# EAGLE design EiBotBoard-v24 (EAGLE 6.5.0)
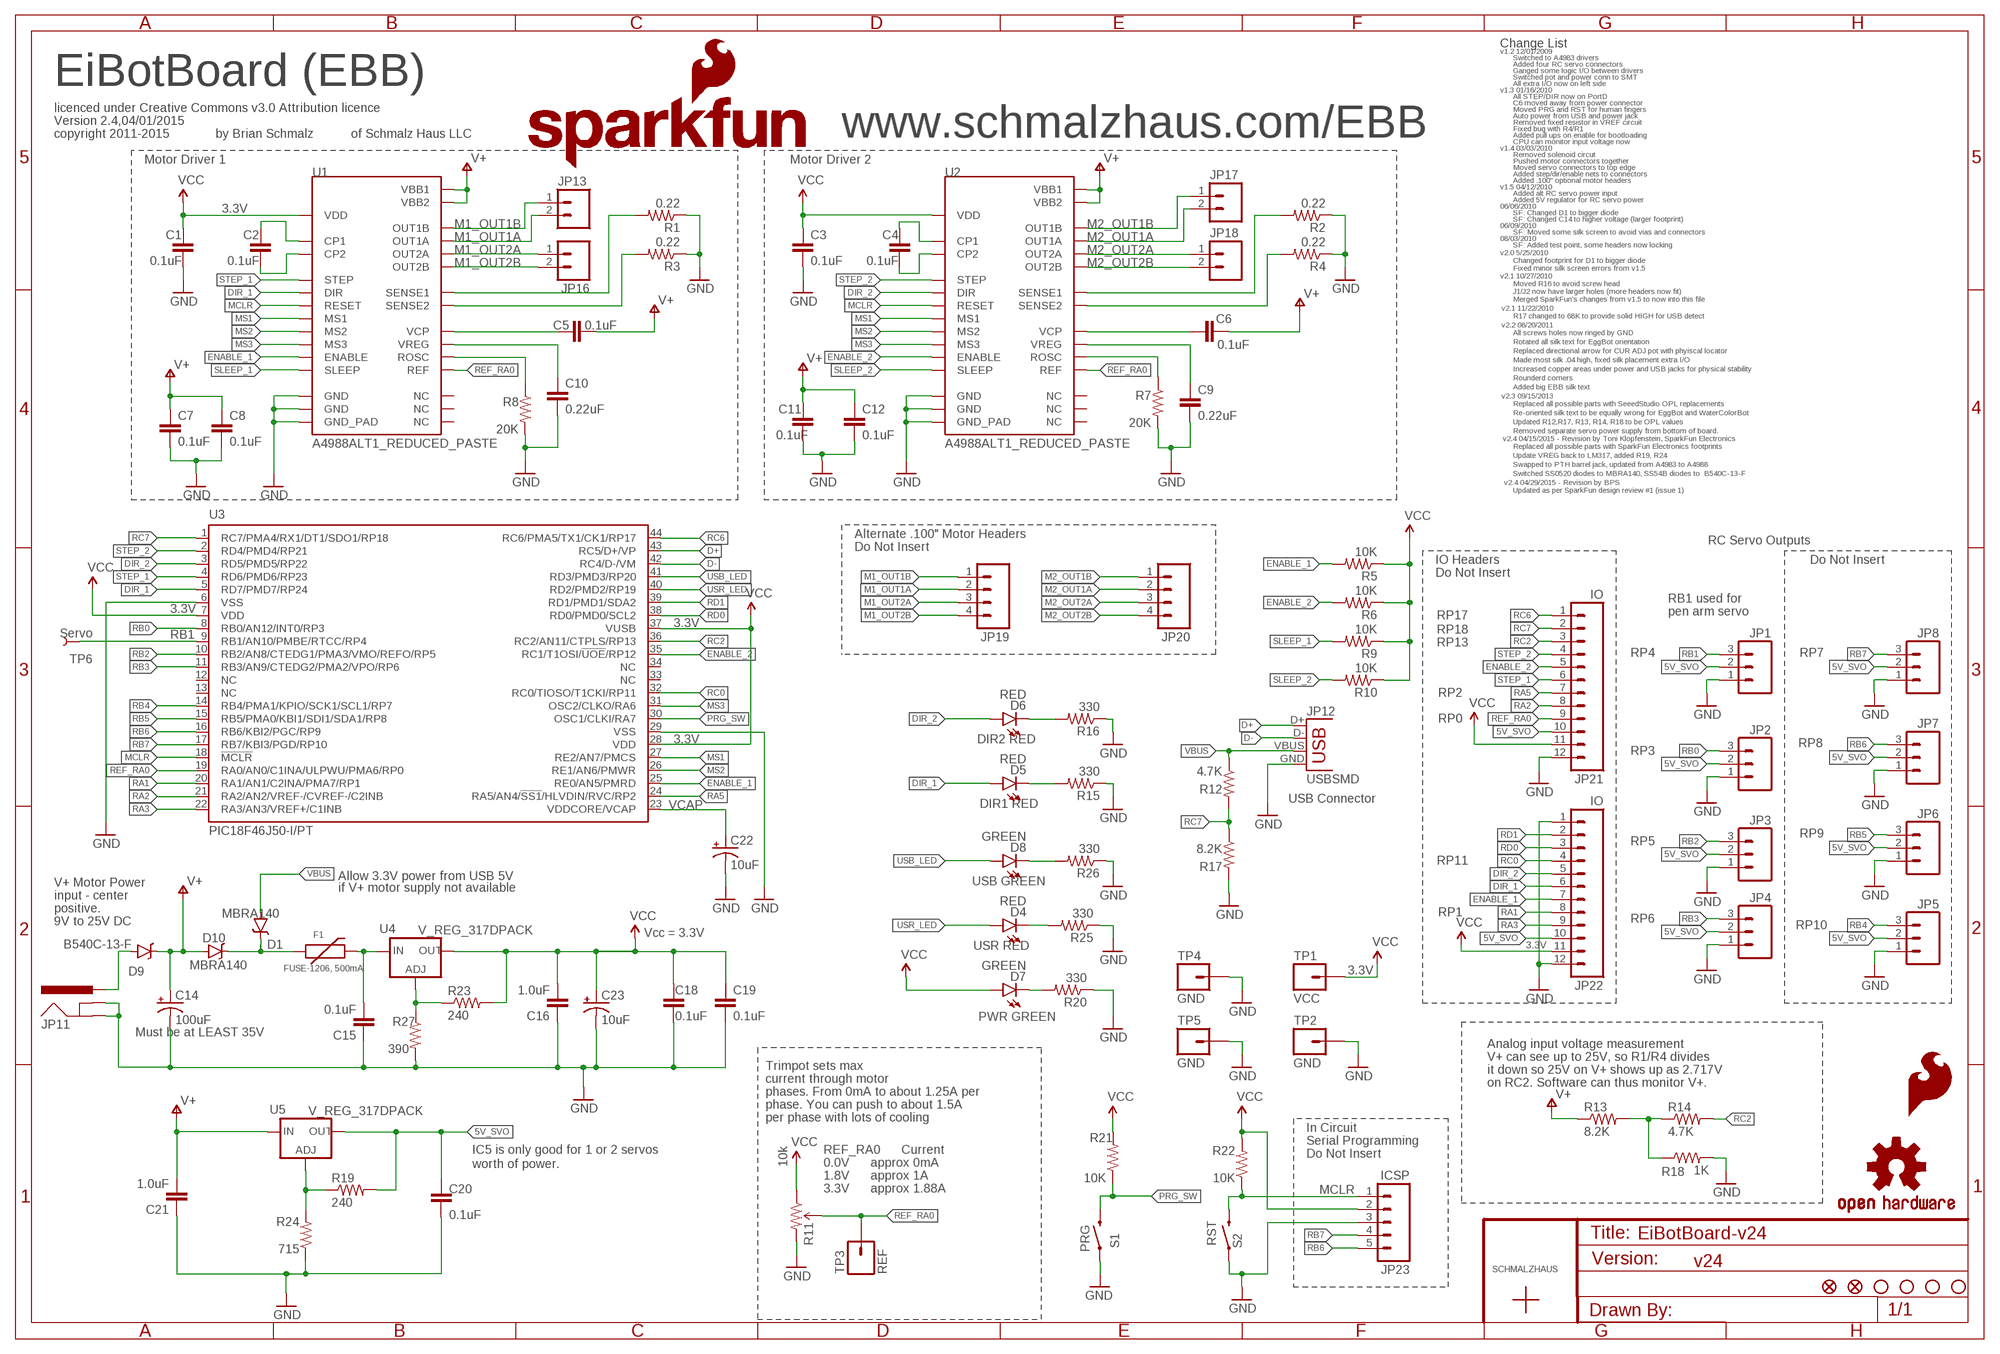
[diagram p0: schematic, sheet 1]

## Parts
C1  0.1uF  0.1UF-100V-10%(0603)  [0603-CAP]
C2  0.1uF  0.1UF-100V-10%(0603)  [0603-CAP]
C3  0.1uF  0.1UF-100V-10%(0603)  [0603-CAP]
C4  0.1uF  0.1UF-100V-10%(0603)  [0603-CAP]
C5  0.1uF  0.1UF-100V-10%(0603)  [0603-CAP]
C6  0.1uF  0.1UF-100V-10%(0603)  [0603-CAP]
C7  0.1uF  0.1UF-100V-10%(0603)  [0603-CAP]
C8  0.1uF  0.1UF-100V-10%(0603)  [0603-CAP]
C9  0.22uF  0.22UF50V-20%,+80%(0603)  [0603-CAP]
C10  0.22uF  0.22UF50V-20%,+80%(0603)  [0603-CAP]
C11  0.1uF  0.1UF-100V-10%(0603)  [0603-CAP]
C12  0.1uF  0.1UF-100V-10%(0603)  [0603-CAP]
C14  100uF  100UF-63V-20%(ELECT)  [NIC_10X10.5_CAP]
C15  0.1uF  0.1UF-100V-10%(0603)  [0603-CAP]
C16  1.0uF  1.0UF-16V-10%(0603)  [0603-CAP]
C18  0.1uF  0.1UF-100V-10%(0603)  [0603-CAP]
C19  0.1uF  0.1UF-100V-10%(0603)  [0603-CAP]
C20  0.1uF  0.1UF-100V-10%(0603)  [0603-CAP]
C21  1.0uF  1.0UF-16V-10%(0603)  [0603-CAP]
C22  10uF  10UF-20V-10%(TANT)  [EIA3528]
C23  10uF  10UF-20V-10%(TANT)  [EIA3528]
D1  MBRA140  DIODE-SCHOTTKY-MBRA140  [SMA-DIODE]
D4  RED  LED-RED0603  [LED-0603]
D5  RED  LED-RED0603  [LED-0603]
D6  RED  LED-RED0603  [LED-0603]
D7  GREEN  LED-GREEN0603  [LED-0603]
D8  GREEN  LED-GREEN0603  [LED-0603]
D9  B540C-13-F  DIODE-SCHOTTKY-B540C-13-F  [SMC]
D10  MBRA140  DIODE-SCHOTTKY-MBRA140  [SMA-DIODE]
F1  FUSE-1206, 500mA  PTCTHERMISTOR1206  [PTC-1206]
JP1  M03LOCK_NO_SILK  [1X03_LOCK_NO_SILK]
JP2  M03LOCK_NO_SILK  [1X03_LOCK_NO_SILK]
JP3  M03LOCK_NO_SILK  [1X03_LOCK_NO_SILK]
JP4  M03LOCK_NO_SILK  [1X03_LOCK_NO_SILK]
JP5  M03LOCK_NO_SILK  [1X03_LOCK_NO_SILK]
JP6  M03LOCK_NO_SILK  [1X03_LOCK_NO_SILK]
JP7  M03LOCK_NO_SILK  [1X03_LOCK_NO_SILK]
JP8  M03LOCK_NO_SILK  [1X03_LOCK_NO_SILK]
JP11  POWER_JACKPTH_LOCK  [POWER_JACK_PTH_LOCK]
JP12  USBSMD  [USB-MINIB]
JP13  M023.5MM_LOCK  [SCREWTERMINAL-3.5MM-2_LOCK]
JP14  FIDUCIAL1X2  [FIDUCIAL-1X2]
JP15  FIDUCIAL1X2  [FIDUCIAL-1X2]
JP16  M023.5MM_LOCK  [SCREWTERMINAL-3.5MM-2_LOCK]
JP17  M023.5MM_LOCK  [SCREWTERMINAL-3.5MM-2_LOCK]
JP18  M023.5MM_LOCK  [SCREWTERMINAL-3.5MM-2_LOCK]
JP19  M04POLAR  [MOLEX-1X4]
JP20  M04POLAR  [MOLEX-1X4]
JP21  IO  M12PTH  [1X12]
JP22  IO  M12PTH  [1X12]
JP23  ICSP  M05NO_SILK  [1X05_NO_SILK]
LOGO1  OSHW-LOGOS  [OSHW-LOGO-S]
LOGO2  SFE_LOGO_FLAME.2_INCH  [SFE_LOGO_FLAME_.2]
LOGO3  SFE_LOGO_NAME_FLAME.2_INCH  [SFE_LOGO_NAME_FLAME_.2]
R1  0.22  0.22OHM-1/4W-1%(0805)  [0805]
R2  0.22  0.22OHM-1/4W-1%(0805)  [0805]
R3  0.22  0.22OHM-1/4W-1%(0805)  [0805]
R4  0.22  0.22OHM-1/4W-1%(0805)  [0805]
R5  10K  10KOHM-1/10W-1%(0603)0603  [0603-RES]
R6  10K  10KOHM-1/10W-1%(0603)0603  [0603-RES]
R7  20K  20KOHM1/10W5%(0603)  [0603-RES]
R8  20K  20KOHM1/10W5%(0603)  [0603-RES]
R9  10K  10KOHM-1/10W-1%(0603)0603  [0603-RES]
R10  10K  10KOHM-1/10W-1%(0603)0603  [0603-RES]
R11  10k  TRIMPOTRES-09285  [TRIMPOT-3MM]
R12  4.7K  4.7KOHM-1/10W-1%(0603)  [0603-RES]
R13  8.2K  8.2KOHM-1/10W-5%(0603)  [0603-RES]
R14  4.7K  4.7KOHM-1/10W-1%(0603)  [0603-RES]
R15  330  330OHM1/10W1%(0603)  [0603-RES]
R16  330  330OHM1/10W1%(0603)  [0603-RES]
R17  8.2K  8.2KOHM-1/10W-5%(0603)  [0603-RES]
R18  1K  1KOHM-1/10W-1%(0603)  [0603-RES]
R19  240  240OHM1/10W1%(0603)  [0603-RES]
R20  330  330OHM1/10W1%(0603)  [0603-RES]
R21  10K  10KOHM-1/10W-1%(0603)0603  [0603-RES]
R22  10K  10KOHM-1/10W-1%(0603)0603  [0603-RES]
R23  240  240OHM1/10W1%(0603)  [0603-RES]
R24  715  715OHM1/10W1%(0603)  [0603-RES]
R25  330  330OHM1/10W1%(0603)  [0603-RES]
R26  330  330OHM1/10W1%(0603)  [0603-RES]
R27  390  390OHM1/10W1%(0603)  [0603-RES]
S1  SWITCH-MOMENTARY-2SMD  [TACTILE-SWITCH-SMD]
S2  SWITCH-MOMENTARY-2SMD  [TACTILE-SWITCH-SMD]
TP1  VCC  M01_WIDENOSLIK  [1X01_NOSILK]
TP2  GND  M01_WIDENOSLIK  [1X01_NOSILK]
TP3  REF  M01PTH  [1X01]
TP4  GND  M01_WIDENOSLIK  [1X01_NOSILK]
TP5  GND  M01_WIDENOSLIK  [1X01_NOSILK]
TP6  Servo  TEST-POINT3X5  [PAD.03X.05]
U1  A4988ALT1_REDUCED_PASTE  [QFN-28-5MM_ALT1_REDUCED_PASTE]
U2  A4988ALT1_REDUCED_PASTE  [QFN-28-5MM_ALT1_REDUCED_PASTE]
U3  PIC18F46J50-I/PT  PIC18F4J50  [TQFP44]
U4  V_REG_317DPACK  [V-REG_DPACK]
U5  V_REG_317DPACK  [V-REG_DPACK]
U$1  SCHMALZHAUSSCHMALZHAUS_SMALL  [SCHMALZHAUS_SMALL]
U$2  STAND-OFF  [STAND-OFF]
U$3  STAND-OFF  [STAND-OFF]
U$4  STAND-OFF  [STAND-OFF]
U$5  STAND-OFF  [STAND-OFF]

## Nets
3.3V: C1.1 C3.1 C16.2 C18.2 C19.2 C23.A(+) D7.A JP21.11 JP22.11 JP23.2 R5.1 R6.1 R9.1 R10.1 R11.1(CCW) R21.2 R22.2 R23.2 TP1.1 U1.P$15(VDD) U2.P$15(VDD) U3.7(VDD) U3.28(VDD) U3.37(VUSB) U4.4(OUT) ; supply symbol labelled VCC
5V_SVO: C20.2 JP1.2 JP2.2 JP3.2 JP4.2 JP5.2 JP6.2 JP7.2 JP8.2 JP21.10 JP22.10 R19.2 U5.4(OUT)
D+: JP12.D+ U3.43(RC5/D+/VP)
D-: JP12.D- U3.42(RC4/D-/VM)
DIR_1: D5.A JP22.6 U1.P$19(DIR) U3.5(RD7/PMD7/RP24)
DIR_2: D6.A JP22.5 U2.P$19(DIR) U3.3(RD5/PMD5/RP22)
ENABLE_1: JP22.7 R5.2 U1.P$2(ENABLE) U3.25(RE0/AN5/PMRD)
ENABLE_2: JP21.5 R6.2 U2.P$2(ENABLE) U3.35(RC1/T1OSI/!UOE!/RP12)
GND: C1.2 C3.2 C7.2 C8.2 C9.2 C10.2 C11.2 C12.2 C14.- C15.1 C16.1 C18.1 C19.1 C20.1 C21.1 C22.C(-) C23.C(-) JP1.1 JP2.1 JP3.1 JP4.1 JP5.1 JP6.1 JP7.1 JP8.1 JP11.GND JP11.GNDBREAK JP12.GND JP21.12 JP22.1 JP22.12 JP23.3 R1.1 R2.1 R3.1 R4.1 R7.2 R8.2 R11.3(CW) R15.1 R16.1 R17.2 R18.2 R20.1 R24.1 R25.1 R26.1 R27.2 S1.1 S2.1 TP2.1 TP4.1 TP5.1 U1.P$3(GND) U1.P$18(GND) U1.P$29(GND_PAD) U2.P$3(GND) U2.P$18(GND) U2.P$29(GND_PAD) U3.6(VSS) U3.29(VSS)
M1_OUT1A: JP13.2 JP19.2 U1.P$24(OUT1A)
M1_OUT1B: JP13.1 JP19.1 U1.P$21(OUT1B)
M1_OUT2A: JP16.1 JP19.3 U1.P$26(OUT2A)
M1_OUT2B: JP16.2 JP19.4 U1.P$1(OUT2B)
M2_OUT1A: JP17.2 JP20.2 U2.P$24(OUT1A)
M2_OUT1B: JP17.1 JP20.1 U2.P$21(OUT1B)
M2_OUT2A: JP18.1 JP20.3 U2.P$26(OUT2A)
M2_OUT2B: JP18.2 JP20.4 U2.P$1(OUT2B)
MCLR: JP23.1 R22.1 S2.3 U1.P$12(RESET) U2.P$12(RESET) U3.18(!MCLR!)
MS1: U1.P$9(MS1) U2.P$9(MS1) U3.27(RE2/AN7/PMCS)
MS2: U1.P$10(MS2) U2.P$10(MS2) U3.26(RE1/AN6/PMWR)
MS3: U1.P$11(MS3) U2.P$11(MS3) U3.31(OSC2/CLKO/RA6)
N$1: D6.C R16.2
N$2: D1.C D10.C F1.1
N$3: C2.1 U1.P$4(CP1)
N$4: R13.2 R14.1 R18.1
N$5: C2.2 U1.P$5(CP2)
N$6: D9.A JP11.PWR
N$7: D5.C R15.2
N$8: D8.C R26.2
N$9: R23.1 R27.1 U4.1(ADJ)
N$10: D4.C R25.2
N$11: D7.C R20.2
N$12: R19.1 R24.2 U5.1(ADJ)
N$16: C4.1 U2.P$4(CP1)
N$17: C4.2 U2.P$5(CP2)
N$19: R8.1 U1.P$13(ROSC)
N$20: C10.1 U1.P$8(VREG)
N$21: C5.1 U1.P$6(VCP)
N$31: R3.2 U1.P$27(SENSE2)
N$32: R1.2 U1.P$23(SENSE1)
N$36: C15.2 F1.2 U4.3(IN)
N$41: C6.1 U2.P$6(VCP)
N$43: R2.2 U2.P$23(SENSE1)
N$44: R4.2 U2.P$27(SENSE2)
N$45: C9.1 U2.P$8(VREG)
N$48: R7.1 U2.P$13(ROSC)
PRG_SW: R21.1 S1.3 U3.30(OSC1/CLKI/RA7)
RA1: JP22.8 U3.20(RA1/AN1/C2INA/PMA7/RP1)
RA2: JP21.8 U3.21(RA2/AN2/VREF-/CVREF-/C2INB)
RA3: JP22.9 U3.22(RA3/AN3/VREF+/C1INB)
RA5: JP21.7 U3.24(RA5/AN4/!SS1!/HLVDIN/RVC/RP2)
RB0: JP2.3 U3.8(RB0/AN12/INT0/RP3)
RB1: JP1.3 TP6.P$1 U3.9(RB1/AN10/PMBE/RTCC/RP4)
RB2: JP3.3 U3.10(RB2/AN8/CTEDG1/PMA3/VMO/REFO/RP5)
RB3: JP4.3 U3.11(RB3/AN9/CTEDG2/PMA2/VPO/RP6)
RB4: JP5.3 U3.14(RB4/PMA1/KPIO/SCK1/SCL1/RP7)
RB5: JP6.3 U3.15(RB5/PMA0/KBI1/SDI1/SDA1/RP8)
RB6: JP7.3 JP23.5 U3.16(RB6/KBI2/PGC/RP9)
RB7: JP8.3 JP23.4 U3.17(RB7/KBI3/PGD/RP10)
RC0: JP22.4 U3.32(RC0/TIOSO/T1CKI/RP11)
RC2: JP21.3 R14.2 U3.36(RC2/AN11/CTPLS/RP13)
RC6: JP21.1 U3.44(RC6/PMA5/TX1/CK1/RP17)
RC7: JP21.2 R12.2 R17.1 U3.1(RC7/PMA4/RX1/DT1/SDO1/RP18)
RD0: JP22.3 U3.38(RD0/PMD0/SCL2)
RD1: JP22.2 U3.39(RD1/PMD1/SDA2)
REF_RA0: JP21.9 R11.2(WIPER) TP3.1 U1.P$17(REF) U2.P$17(REF) U3.19(RA0/AN0/C1INA/ULPWU/PMA6/RP0)
SLEEP_1: R9.2 U1.P$14(SLEEP)
SLEEP_2: R10.2 U2.P$14(SLEEP)
STEP_1: JP21.6 U1.P$16(STEP) U3.4(RD6/PMD6/RP23)
STEP_2: JP21.4 U2.P$16(STEP) U3.2(RD4/PMD4/RP21)
USB_LED: D8.A U3.41(RD3/PMD3/RP20)
USR_LED: D4.A U3.40(RD2/PMD2/RP19)
V+: C5.2 C6.2 C7.1 C8.1 C11.1 C12.1 C14.+ C21.2 D9.C D10.A R13.1 U1.P$22(VBB1) U1.P$28(VBB2) U2.P$22(VBB1) U2.P$28(VBB2) U5.3(IN)
VBUS: D1.A JP12.VBUS R12.1
VCAP: C22.A(+) U3.23(VDDCORE/VCAP)
Unconnected: U1.P$7(NC) U1.P$20(NC) U1.P$25(NC) U2.P$7(NC) U2.P$20(NC) U2.P$25(NC) U3.12(NC) U3.13(NC) U3.33(NC) U3.34(NC)

## Notes on the sheet
- Change List
- v1.2 12/01/2009
- Switched to A4983 drivers
- Added four RC servo connectors
- Ganged some logic I/O between drivers
- Switched pot and power conn to SMT
- EiBotBoard (EBB) | All extra I/O now on left side
- v1.3 01/16/2010
- All STEP/DIR now on PortD
- C6 moved away from power connector
- licenced under Creative Commons v3.0 Attribution licence | Moved PRG and RST for human fingers
- Auto power from USB and power jack
- Version 2.4,04/01/2015 | Removed fixed resistor in VREF circuit
- Fixed bug with R4/R1
- copyright 2011-2015 | by Brian Schmalz | of Schmalz Haus LLC | www.schmalzhaus.com/EBB | Added pull ups on enable for bootloading
- CPU can monitor input voltage now
- v1.4 03/03/2010
- Removed solenoid circut
- Motor Driver 1 | Motor Driver 2 | Pushed motor connectors together
- Moved servo connectors to top edge
- Added step/dir/enable nets to connectors
- Added .100" optional motor headers
- v1.5 04/12/2010
- Added alt RC servo power input
- Added 5V regulator for RC servo power
- 06/06/2010
- SF: Changed D1 to bigger diode
- SF: Changed C14 to higher voltage (larger footprint)
- 06/09/2010
- SF: Moved some silk screen to avoid vias and connectors
- 08/03/2010
- SF: Added test point, some headers now locking
- v2.0 5/25/2010
- Changed footprint for D1 to bigger diode
- Fixed minor silk screen errors from v1.5
- v2.1 10/27/2010
- Moved R16 to avoid screw head
- J1/J2 now have larger holes (more headers now fit)
- Merged SparkFun's changes from v1.5 to now into this file
- v2.1 11/22/2010
- R17 changed to 68K to provide solid HIGH for USB detect
- v2.2 08/20/2011
- All screws holes now ringed by GND
- Rotated all silk text for EggBot orientation
- Replaced directional arrow for CUR ADJ pot with phyiscal locator
- Made most silk .04 high, fixed silk placement extra I/O
- Increased copper areas under power and USB jacks for physical stability
- Rounderd corners
- Added big EBB silk text
- v2.3 09/15/2013
- Replaced all possible parts with SeeedStudio OPL replacements
- Re-oriented silk text to be equally wrong for EggBot and WaterColorBot
- Updated R12,R17, R13, R14, R18 to be OPL values
- Removed separate servo power supply from bottom of board.
- v2.4 04/15/2015 - Revision by Toni Klopfenstein, SparkFun Electronics
- Replaced all possible parts with SparkFun Electronics footprints
- Update VREG back to LM317, added R19, R24
- Swapped to PTH barrel jack, updated from A4983 to A4988
- Switched SS0520 diodes to MBRA140, SS54B diodes to  B540C-13-F
- v2.4 04/29/2015 - Revision by BPS
- Updated as per SparkFun design review #1 (issue 1)
- Alternate .100" Motor Headers
- RC Servo Outputs
- Do Not Insert
- IO Headers | Do Not Insert
- Do Not Insert
- RB1 used for
- pen arm servo
- RP17
- RP18
- RP13
- RP4 | RP7
- RP2
- RP0
- DIR2 RED
- RP8
- RP3
- USB Connector
- DIR1 RED
- RP9
- RP5
- RP11
- Allow 3.3V power from USB 5V
- V+ Motor Power | USB GREEN
- if V+ motor supply not available
- input - center
- positive.
- RP1
- 9V to 25V DC | RP6
- RP10
- Vcc = 3.3V
- USR RED
- PWR GREEN
- Must be at LEAST 35V
- Analog input voltage measurement
- V+ can see up to 25V, so R1/R4 divides
- Trimpot sets max
- it down so 25V on V+ shows up as 2.717V
- current through motor
- on RC2. Software can thus monitor V+.
- phases. From 0mA to about 1.25A per
- phase. You can push to about 1.5A
- per phase with lots of cooling
- In Circuit
- Serial Programming
- IC5 is only good for 1 or 2 servos | REF_RA0      Current
- Do Not Insert
- worth of power. | 0.0V      approx 0mA
- 1.8V      approx 1A
- 3.3V      approx 1.88A
- PRG
- RST
- v24

## Library data of the parts
C1-C8 C11 C12 C15 C18-C20 = SparkFun-Capacitors:0.1UF-100V-10%(0603): CAP-08390; PROD_ID: CAP-08390
C9 C10 = SparkFun-Capacitors:0.22UF50V-20%,+80%(0603): CAP-09885; PROD_ID: CAP-09885
C14 = SparkFun-Capacitors:100UF-63V-20%(ELECT): CAP-08362 100uF electrolytic SMT 63V 20%; PROD_ID: CAP-08362
C16 C21 = SparkFun-Capacitors:1.0UF-16V-10%(0603): CAP-00868; PROD_ID: CAP-00868
C22 C23 = SparkFun-Capacitors:10UF-20V-10%(TANT): CAP-08063; PROD_ID: CAP-08063
D1 D10 = SparkFun-DiscreteSemi:DIODE-SCHOTTKY: Schottky diodes in SFE's production catalog; PROD_ID: DIO-08053
D4-D6 = SparkFun-LED:LED-RED: Assorted Red LEDs LilyPad 1206- DIO-09912 1206- DIO-00809 0603- DIO-00819 "SMART" means more efficient and expensive; PROD_ID: DIO-00819
D7 D8 = SparkFun-LED:LED-GREEN: Various green LEDs Green LEDs used in SFE Production 0603- DIO-00821 LARGE- DIO-00862 LILYPAD- DIO-09910; PROD_ID: DIO-00821
D9 = Testing:DIODE-SCHOTTKY: Schottky diodes in SFE's production catalog; PROD_ID: PROTOTYPE
F1 = SparkFun-PowerIC:PTC: Resettable Fuse PTC Resettable Fuse. Spark Fun Electronics SKU : COM-08357; PROD_ID: RES-08585
JP1-JP8 = SparkFun-Connectors:M03: Header 3 Standard 3-pin 0.1" header. Use with straight break away headers (SKU : PRT-00116), right angle break away headers (PRT-00553), swiss pins (PRT-00743), machine pins (PRT-00117), and female headers (PRT-00115). Molex polarized connector foot print use with SKU : PRT-08232 with associated crimp pins and housings.
JP11 = SparkFun-Connectors:POWER_JACK: Power Jack This is the standard 5.5mm barrel jack for power. The PTH is the most common, proven, reliable, footprint. The Slot footprint only works if the mill layer is transmitted to the PCB fab house so be warned. Mating wall wart : TOL-00298 (and others); PROD_ID: CONN-08197; SF_ID: PRT-00119
JP12 = SparkFun-Connectors:USB: USB Connectors USB-B-PTH is fully proven SKU : PRT-00139/CONN-08278 USB-miniB is fully proven SKU : PRT-00587 USB-A-PCB is untested. USB-A-H is throughly reviewed, but untested. Spark Fun Electronics SKU : PRT-00437 USB-B-SMT is throughly reviewed, but untested. Needs silkscreen touching up. USB-A-S has not been used/tested USB-MB-H has not been used/tested USB-MICROB has been used. CONN-09505; PROD_ID: CONN-08193
JP13 JP16-JP18 = SparkFun-Connectors:M02: Standard 2-pin 0.1" header. Use with - straight break away headers ( PRT-00116) - right angle break away headers (PRT-00553) - swiss pins (PRT-00743) - machine pins (PRT-00117) - female headers (PRT-00115) Molex polarized connector foot print use with: PRT-08233 with associated crimp pins and housings. 2.54_SCREWTERM for use with PRT-10571. 3.5mm Screw Terminal footprints for PRT-08084 5mm Screw Terminal footprints for use with PRT-08432; PROD_ID: CONN-08399
JP14 JP15 = SparkFun-Aesthetics:FIDUCIAL: Fiducial Alignment Points Various fiducial points for machine vision alignment.
JP19 JP20 = SparkFun-Connectors:M04: Header 4 Standard 4-pin 0.1" header. Use with straight break away headers (SKU : PRT-00116), right angle break away headers (PRT-00553), swiss pins (PRT-00743), machine pins (PRT-00117), and female headers (PRT-00115). Molex polarized connector foot print use with SKU : PRT-08231 with associated crimp pins and housings. 1MM SMD Version SKU: PRT-10208
JP21 JP22 = SparkFun-Connectors:M12: Header 12 Standard 12-pin 0.1" header. Use with straight break away headers (SKU : PRT-00116), right angle break away headers (PRT-00553), swiss pins (PRT-00743), machine pins (PRT-00117), and female headers (PRT-00115).
JP23 = SparkFun-Connectors:M05: Header 5 Standard 5-pin 0.1" header. Use with straight break away headers (SKU : PRT-00116), right angle break away headers (PRT-00553), swiss pins (PRT-00743), machine pins (PRT-00117), and female headers (PRT-00115). Molex polarized connector foot print use with SKU : PRT-08230 with associated crimp pins and housings.
LOGO1 = SparkFun-Aesthetics:OSHW-LOGO: Open Source Hardware Logo This logo indicates the piece of hardware it is found on incorporates a OSHW license and/or adheres to the definition of open source hardware found here: http://freedomdefined.org/OSHW
LOGO2 = SparkFun-Aesthetics:SFE_LOGO_FLAME: SFE Logo, flame only This is the SparkFun flame logo. The logo on the schematic will always be the same size; the package variant is the height of the flame. Default layer for the logo on the board is tSilk.
LOGO3 = SparkFun-Aesthetics:SFE_LOGO_NAME_FLAME: SFE Logo, name and flame This is the SparkFun full logo. The logo on the schematic will always be the same size; the package variant is the height of the flame part of the logo. Default layer for the logo on the board is tSilk.
R1-R4 = SparkFun-Resistors:0.22OHM-1/4W-1%(0805): RES-09883; PROD_ID: RES-09883
R5 R6 R9 R10 R21 R22 = SparkFun-Resistors:10KOHM-1/10W-1%(0603): RES-00824; PROD_ID: RES-00824
R7 R8 = SparkFun-Resistors:20KOHM1/10W5%(0603): RES-09231; PROD_ID: RES-09231
R11 = SparkFun-Electromechanical:TRIMPOT: Various small potentiometers for "set-and-forget" applications; PROD_ID: RES-09285
R12 R14 = SparkFun-Resistors:4.7KOHM-1/10W-1%(0603): RES-07857; PROD_ID: RES-07857
R13 R17 = SparkFun-Resistors:8.2KOHM-1/10W-5%(0603): RES-10646; PROD_ID: RES-10646
R15 R16 R20 R25 R26 = SparkFun-Resistors:330OHM1/10W1%(0603): RES-00818; PROD_ID: RES-00818
R18 = SparkFun-Resistors:1KOHM-1/10W-1%(0603): RES-07856; PROD_ID: RES-07856
R19 R23 = SparkFun-Resistors:240OHM1/10W1%(0603): RES-07849; PROD_ID: RES-07849
R24 = SparkFun-Resistors:715OHM1/10W1%(0603): RES-07850; PROD_ID: RES-07850
R27 = SparkFun-Resistors:390OHM1/10W1%(0603): RES-07864; PROD_ID: RES-07864
S1 S2 = SparkFun-Electromechanical:SWITCH-MOMENTARY-2: Various NO switches- pushbuttons, reed, etc; PROD_ID: SWCH-08247
TP1 TP2 TP4 TP5 = SchmalzHaus:M01_WIDE: Header 1 Standard 1-pin 0.1" header. Use with straight break away headers (SKU : PRT-00116), right angle break away headers (PRT-00553), swiss pins (PRT-00743), machine pins (PRT-00117), and female headers (PRT-00115).
TP3 = SparkFun-Connectors:M01: Header 1 Standard 1-pin 0.1" header. Use with straight break away headers (SKU : PRT-00116), right angle break away headers (PRT-00553), swiss pins (PRT-00743), machine pins (PRT-00117), and female headers (PRT-00115).
TP6 = SparkFun-Passives:TEST-POINT: Bare copper test points for troubleshooting or ICT
U1 U2 = SparkFun-PowerIC:A4988: DMOS Microstepping Driver with Translator; PROD_ID: IC-11483
U3 = Testing:PIC18F4*J50; PROD_ID: IC-09891
U4 U5 = SparkFun-PowerIC:V_REG_317: Voltage Regulator Standard LM317 adjustable voltage regulator. AOI (Adjust Output Input). Google 'LM317 Calculator' for easy to use app to get the two resistor values needed. 240/720 for 5V output. 240/390 for 3.3V output. Spark Fun Electronics SKU : COM-00527; PROD_ID: IC-09888
U$1 = SchmalzHaus:SCHMALZHAUS
U$2-U$5 = SparkFun-Electromechanical:STAND-OFF: #4 Stand Off This is the mechanical footprint for a #4 phillips button head screw. Use the keepout ring to avoid running the screw head into surrounding components. SKU : PRT-00447

## Board
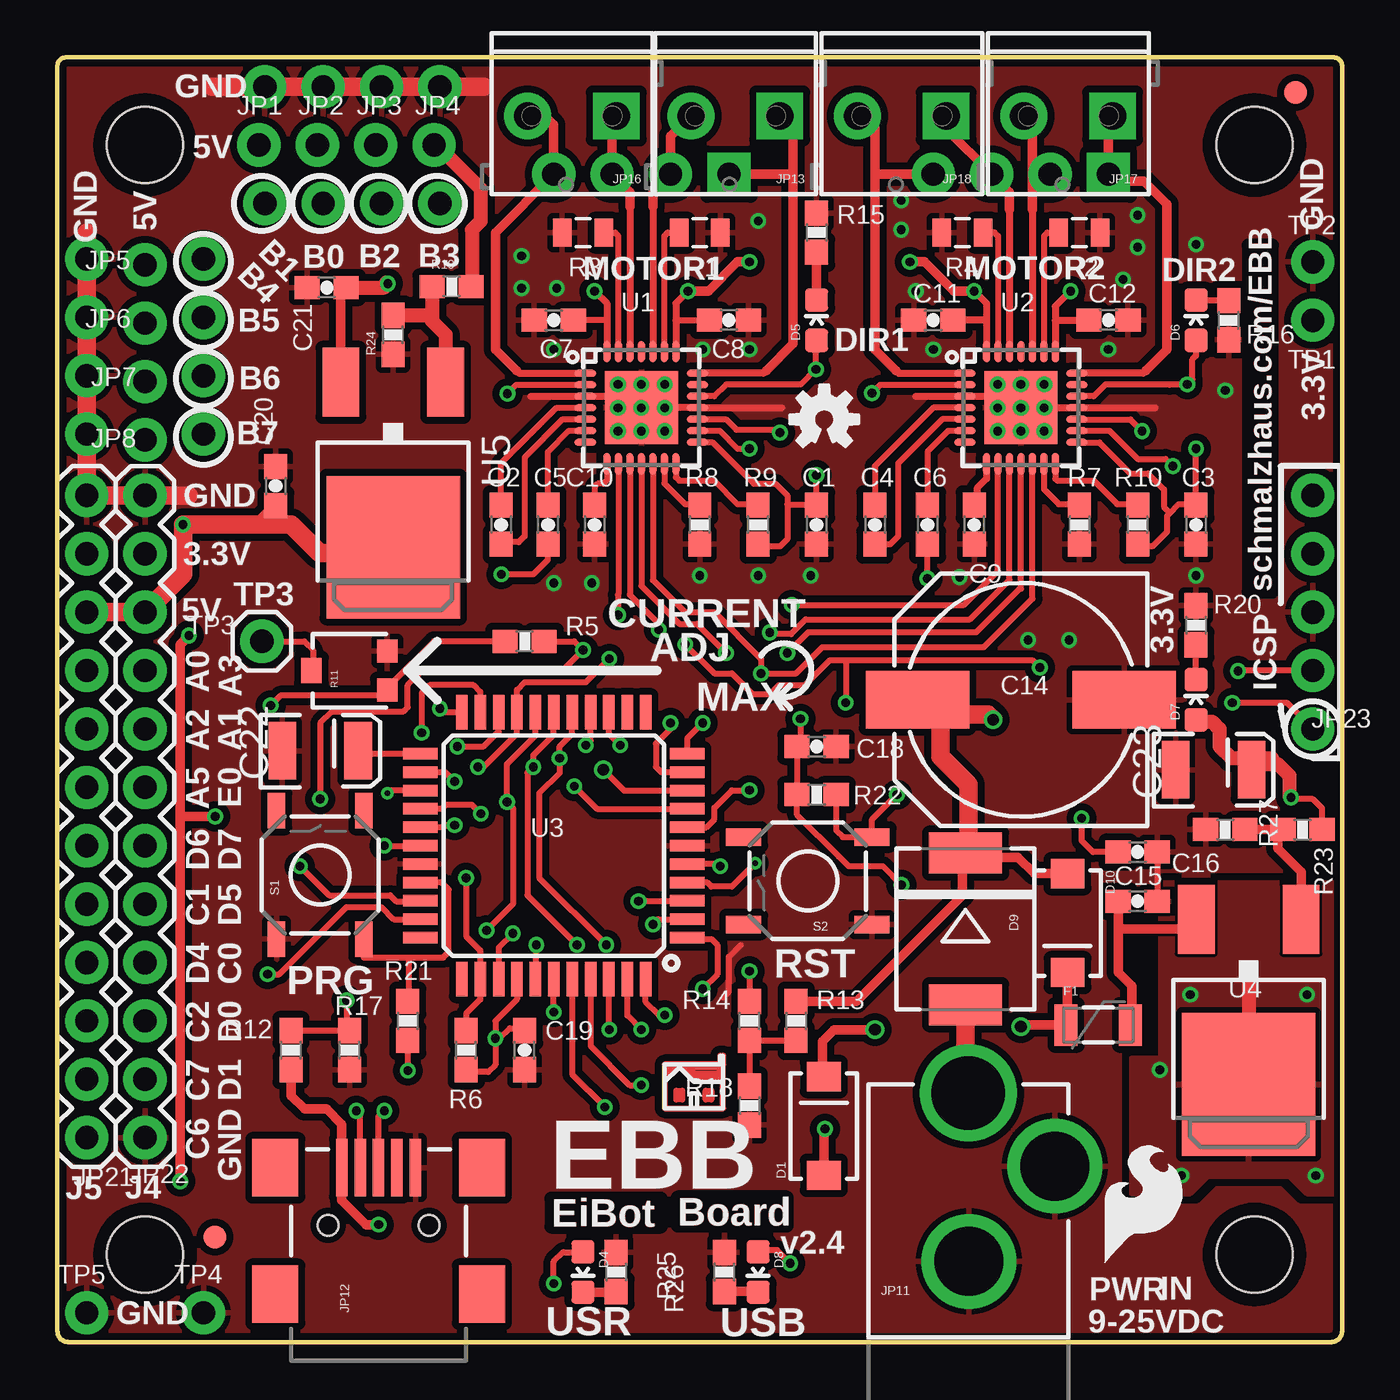
[diagram p1: board, top side]
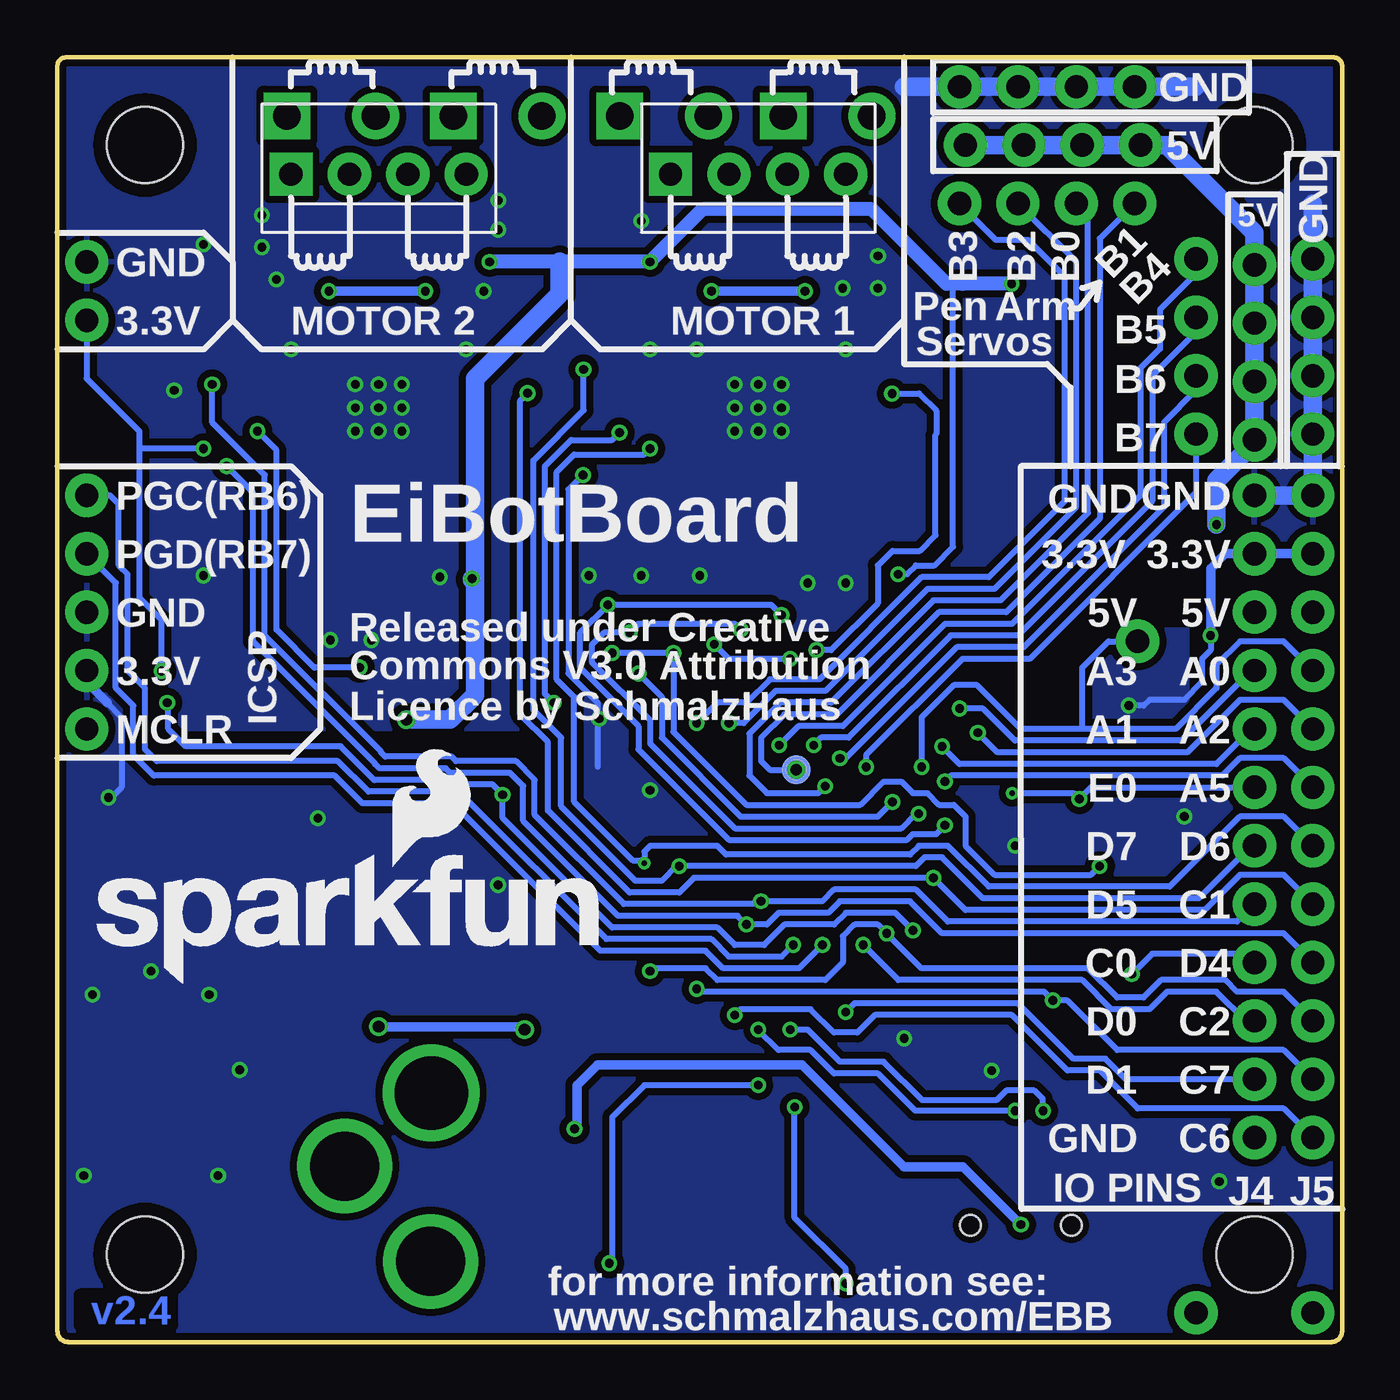
[diagram p2: board, bottom side, seen from below]

Size 55.88 x 55.88 mm. Coordinates in mm from the lower left corner, seen from the top.
Outline: 55.42,0 arc90 55.88,0.46 55.88,55.54 arc90 55.54,55.88 0.34,55.88 arc90 0,55.54 0,0.46 arc90 0.46,0 55.42,0
Copper layers (1*16): Top 0.035mm / dielectric 1.5mm / Bottom 0.035mm
Design rules "dirt_cheap_dirty_boards.v1": minimum track width 5mil, minimum drill 12mil, track to track 5mil, track to pad 5mil, pad to pad 5mil, via to via 5mil, smd to smd 0mil, copper to edge 10mil, drill to drill 10mil, minimum pad ring 10mil, minimum via ring 6mil, stop-mask expansion 2mil, vias tented up to drill 25mil, thermal gap 10mil

### Footprints (pad centres in the part's own frame; a part is rotated, then mirrored left to right if it is on the bottom)
0603-CAP = smd 1.1 x 1: 1 -0.85,0; 2 0.85,0
NIC_10X10.5_CAP = smd 4.5 x 2.5: + 4.5,0; - -4.5,0
EIA3528 = smd 1.2 x 2.5: A 1.65,0; C -1.65,0
SMA-DIODE = smd 1.27 x 1.47: A -2.15,0; C 2.15,0
LED-0603 = smd 1 x 1: A 0,-0.877; C 0,0.877
SMC = smd 1.778 x 3.175: A 3.302,0; C -3.302,0
PTC-1206 = smd 1 x 1.8: 1 -1.4,0; 2 1.4,0
1X03_LOCK_NO_SILK = drill 1.016 pad 1.88: 1 0,0.127; 2 2.54,-0.127; 3 5.08,0.127
POWER_JACK_PTH_LOCK = drill 2.997 pad 4.115: GND 0.025,6.557; GNDBREAK 3.762,10.7 | drill 3.2 pad 4.115: PWR 0,13.878
USB-MINIB = smd 2.5 x 0.5: D+ 2.5,0; D- 2.5,0.8; GND 2.5,-1.6; ID 2.5,-0.8; VBUS 2.5,1.6 | smd 2.5 x 2: MTN1 -3,4.5; MTN2 2.5,4.5; MTN3 -3,-4.5; MTN4 2.5,-4.5 | hole 0.9: 0,2.2; 0,-2.2
SCREWTERMINAL-3.5MM-2_LOCK = drill 1.2 pad 2.032 square: 1 -0.178,0 | drill 1.2 pad 2.032: 2 3.678,0
FIDUCIAL-1X2 = smd 1 x 1: 1 0,0
MOLEX-1X4 = drill 1.016 pad 1.88 square: 1 0,0 | drill 1.016 pad 1.88: 2 2.54,0; 3 5.08,0; 4 7.62,0
1X12 = drill 1.016 pad 1.88: 1 0,0; 2 2.54,0; 3 5.08,0; 4 7.62,0; 5 10.16,0; 6 12.7,0; 7 15.24,0; 8 17.78,0; 9 20.32,0; 10 22.86,0; 11 25.4,0; 12 27.94,0
1X05_NO_SILK = drill 1.016 pad 1.88: 1 0,0; 2 2.54,0; 3 5.08,0; 4 7.62,0; 5 10.16,0
0805 = smd 0.8 x 1.2: 1 -0.9,0; 2 0.9,0
0603-RES = smd 1.1 x 1: 1 -0.85,0; 2 0.85,0
TRIMPOT-3MM = smd 1 x 0.9: 1 -0.85,-1.65; 3 0.85,-1.65 | smd 1.1 x 0.9: 2 0,1.65
TACTILE-SWITCH-SMD = smd 1.524 x 0.762: 1 -2.794,1.905; 2 2.794,1.905; 3 -2.794,-1.905; 4 2.794,-1.905
1X01_NOSILK = drill 1.016 pad 1.88: 1 0,0
1X01 = drill 1.016 pad 1.88: 1 0,0
PAD.03X.05 = smd 1.27 x 1.27: P$1 0,0
QFN-28-5MM_ALT1_REDUCED_PASTE = smd 0.94 x 0.3: P$1 -2.44,1.5; P$2 -2.44,1; P$3 -2.44,0.5; P$4 -2.44,0; P$5 -2.44,-0.5; P$6 -2.44,-1; P$7 -2.44,-1.5; P$15 2.44,-1.5; P$16 2.44,-1; P$17 2.44,-0.5; P$18 2.44,0; P$19 2.44,0.5; P$20 2.44,1; P$21 2.44,1.5 | smd 0.3 x 0.94: P$8 -1.5,-2.44; P$9 -1,-2.44; P$10 -0.5,-2.44; P$11 0,-2.44; P$12 0.5,-2.44; P$13 1,-2.44; P$14 1.5,-2.44; P$22 1.5,2.44; P$23 1,2.44; P$24 0.5,2.44; P$25 0,2.44; P$26 -0.5,2.44; P$27 -1,2.44; P$28 -1.5,2.44 | smd 3.175 x 3.175: P$29 0,0
TQFP44 = smd 1.5 x 0.5: 1 -5.8,4; 2 -5.8,3.2; 3 -5.8,2.4; 4 -5.8,1.6; 5 -5.8,0.8; 6 -5.8,0; 7 -5.8,-0.8; 8 -5.8,-1.6; 9 -5.8,-2.4; 10 -5.8,-3.2; 11 -5.8,-4; 23 5.8,-4; 24 5.8,-3.2; 25 5.8,-2.4; 26 5.8,-1.6; 27 5.8,-0.8; 28 5.8,0; 29 5.8,0.8; 30 5.8,1.6; 31 5.8,2.4; 32 5.8,3.2; 33 5.8,4 | smd 0.5 x 1.5: 12 -4,-5.8; 13 -3.2,-5.8; 14 -2.4,-5.8; 15 -1.6,-5.8; 16 -0.8,-5.8; 17 0,-5.8; 18 0.8,-5.8; 19 1.6,-5.8; 20 2.4,-5.8; 21 3.2,-5.8; 22 4,-5.8; 34 4,5.8; 35 3.2,5.8; 36 2.4,5.8; 37 1.6,5.8; 38 0.8,5.8; 39 0,5.8; 40 -0.8,5.8; 41 -1.6,5.8; 42 -2.4,5.8; 43 -3.2,5.8; 44 -4,5.8
V-REG_DPACK = smd 1.6 x 3: 1 -2.28,-4.8; 3 2.28,-4.8 | smd 5.8 x 6.2: 4 0,2.38
STAND-OFF = hole 3.302: 0,0

### Placement (x,y rotation side)
C1  33.02,35.56 270 top
C2  19.3,35.56 270 top
C3  49.53,35.56 270 top
C4  35.56,35.56 270 top
C5  21.34,35.56 270 top
C6  37.85,35.56 270 top
C7  21.59,44.45 180 top
C8  29.21,44.45 0 top
C9  39.88,35.56 270 top
C10  23.37,35.56 270 top
C11  38.1,44.45 180 top
C12  45.72,44.45 0 top
C14  41.91,27.94 180 top
C15  46.99,19.18 180 top
C16  46.99,21.31 180 top
C18  33.02,25.91 180 top
C19  20.32,12.7 90 top
C20  9.5,37.24 270 top
C21  11.71,45.87 0 top
C22  11.43,25.72 0 top
C23  50.29,24.89 0 top
D1  33.34,9.4 90 top
D4  22.86,3.05 180 top
D5  33.02,44.45 0 top
D6  49.53,44.45 0 top
D7  49.53,27.94 0 top
D8  30.48,3.05 180 top
D9  39.5,17.97 270 top
D10  43.94,18.22 270 top
F1  45.28,13.79 0 top
JP1  8.89,54.61 270 top
JP2  11.43,54.61 270 top
JP3  13.97,54.61 270 top
JP4  16.51,54.61 270 top
JP5  1.27,46.99 0 top
JP6  1.27,44.45 0 top
JP7  1.27,41.91 0 top
JP8  1.27,39.37 0 top
JP11  39.62,-3.05 0 top
JP12  13.97,5.08 90 top
JP13  31.24,53.34 180 top
JP14  53.85,54.36 0 top
JP15  6.86,4.57 0 top
JP16  24.13,53.34 180 top
JP17  45.72,53.34 180 top
JP18  38.48,53.34 180 top
JP19  29.21,50.8 0 bottom
JP20  45.72,50.8 0 bottom
JP21  1.27,8.89 90 top
JP22  3.81,8.89 90 top
JP23  54.61,26.67 90 top
LOGO1  33.35,40.13 0 top
LOGO2  45.21,3.17 0 top
LOGO3  54.86,15.49 0 bottom
R1  27.94,48.26 180 top
R2  44.45,48.26 180 top
R3  22.86,48.26 0 top
R4  39.37,48.26 0 top
R5  20.32,30.48 0 top
R6  17.78,12.7 90 top
R7  44.45,35.56 270 top
R8  27.94,35.56 270 top
R9  30.48,35.56 90 top
R10  46.99,35.56 90 top
R11  12.7,29.21 90 top
R12  10.16,12.7 90 top
R13  32.13,13.97 270 top
R14  30.1,13.97 90 top
R15  33.02,48.26 270 top
R16  50.95,44.45 90 top
R17  12.7,12.7 270 top
R18  30.1,10.29 270 top
R19  17.14,45.91 0 top
R20  49.53,31.18 270 top
R21  15.24,13.97 270 top
R22  33.02,23.81 180 top
R23  54.17,22.29 0 top
R24  14.61,43.81 90 top
R25  24.31,3.05 270 top
R26  29.01,3.05 270 top
R27  50.8,22.29 180 top
S1  11.43,20.32 90 top
S2  32.64,20.07 180 top
TP1  54.61,44.45 0 top
TP2  54.61,46.99 0 top
TP3  8.89,30.48 0 top
TP4  6.35,1.27 0 top
TP5  1.27,1.27 0 top
TP6  23.75,24.89 0 bottom
U1  25.4,40.64 0 top
U2  41.91,40.64 0 top
U3  21.59,21.59 180 top
U4  51.82,13.59 180 top
U5  14.61,36.96 180 top
U$1  27.69,10.17 0 top
U$2  52.07,3.81 0 top
U$3  3.81,3.81 0 top
U$4  52.07,52.07 0 top
U$5  3.81,52.07 0 top

### Tracks (layer width: path | path; a pad name or v marks a point on that pad's centre or on a via)
3.3V  (via drill 0.38)
  Top 0.254: v33.02,37.72 C1.1 31.79,36.41 31.75,36.45 | U3.37 19.99,14.91 19.05,13.97 v19.05,13.21 | 48.39,36.07 48.26,35.94 48.26,35.24 47.62,34.61 47.09,34.61 R10.1 | 48.39,36.07 48.77,36.45 49.49,36.45 | v49.53,38.86 C3.1 49.49,36.45 | R21.2 v15.24,11.81 15.28,11.85 | v19.05,13.21 19.05,12.06 18.73,11.75 17.88,11.75 R6.1 | U3.7 28.23,22.39 28.57,22.73 28.57,23.24 29.34,24 v30.1,24 | v14.22,21.59 U3.28 | 48.39,36.07 48.13,36.32 48.13,37.08 47.43,37.78 46.67,37.78 45.33,39.13 44.45,39.13 | 33.98,21.12 33.98,21.13 | v44.55,22.78 44.55,21.81 45.05,21.31 C16.2 | 32.18,23.93 32.19,23.94 32.19,23.84 R22.2 | 49.49,36.45 49.49,36.36 | R9.1 30.58,34.61 31.43,34.61 31.75,34.92 31.75,36.45 | v19.05,13.21 19.24,13.21 19.68,13.65 20.22,13.65 C19.2 | 44.31,39.13 44.45,39.13 | U2.P$15 44.44,39.14 44.45,39.13 | R5.1 16.38,30.48 14.48,28.57 14.29,28.57 14.29,28.42 R11.1 14.15,28.16 14.15,28.12 9.71,28.12 v9.27,27.69 | 32.26,25.65 32.32,25.72 32.32,25.76 C18.2 | U1.P$15 28.49,39.14 30.29,37.34 31.24,37.34 31.75,36.83 31.75,36.45 | R23.2 55.02,23.22 54.61,23.62 53.72,23.62 v53.66,23.69 | v32.32,27.11 32.32,26.06 C18.2 | C18.2 R22.2 | 33.98,21.12 32.17,22.93 R22.2 | 33.98,21.12 34,21.12 34.42,20.7 35.9,20.7 v36.72,19.89 | 51.82,25.15 51.82,25.02 C23.A | JP23.2 51.38,29.21 v51.36,29.18
  Top 0.406: 5.33,22.86 v5.33,6.99 | 5.33,22.86 v6.86,22.86 | 5.33,22.86 5.33,30.35 v5.71,30.73
  Top 0.61: v51.82,16.13 U4.4 | D7.A 49.6,26.99 50.23,26.99 50.55,26.67 50.55,25.91 51.05,25.4 51.43,25.4 | 51.43,25.4 52.83,25.4 | 51.43,25.4 C23.A | 51.82,25.15 53.09,25.15 53.59,24.64 53.59,23.75 v53.66,23.69
  Bottom 0.254: v33.02,37.72 33.66,37.08 33.66,29.08 32.38,27.81 32.38,25.02 | v51.36,29.18 51.36,31.42 52.32,32.38 52.32,38.86 | 5.71,33.66 5.71,32 | v5.71,30.73 5.71,30.1 6.1,29.72 6.1,28.7 6.86,27.94 8.38,27.94 8.64,27.69 v9.27,27.69 | TP1.1 54.61,41.91 52.32,39.62 52.32,38.86 | v49.53,38.86 52.32,38.86 | 53.72,27.81 53.09,27.18 53.09,24.13 53.59,23.62
  Bottom 0.406: JP21.11 JP22.11 5.08,34.29 5.71,33.66 v5.71,30.73 | JP23.2 54.61,28.7 53.72,27.81
  other vias: 47.96,11.84 54.74,7.24 48.9,7.24 54.36,15.11 49.28,15.11
  pour Bottom (isolate 0.305, rank 3): 0,27.94 0,0 55.88,0 55.88,29.21 52.07,29.21 52.07,25.4 39.37,25.4 33.02,30.99 6.73,30.99 6.73,27.94
  pour Top: 46.74,12.32 46.74,6.48 49.28,6.48 50.04,7.24 53.59,7.24 54.36,6.48 55.63,6.48 55.63,19.94 48.01,19.94 48.01,12.32
5V_SVO  (via drill 0.38)
  Top 0.61: JP4.2 16.51,52.07 18.41,50.16 18.41,48.77 18.03,48.39 18.03,45.95 R19.2
  Top 0.813: JP21.10 JP22.10 5.46,33.4 v5.46,35.56 8.89,35.56 | 8.89,35.56 10.16,35.56 11.4,34.32 14.35,34.32 U5.4 | C20.2 9.5,36.17 8.89,35.56
  Bottom 0.406: JP8.2 3.81,39.12 | 6.35,50.8 6.35,50.67 5.71,50.04 5.84,50.04
  Bottom 0.813: JP4.2 JP3.2 JP2.2 JP1.2 7.62,52.07 6.35,50.8 3.81,48.26 JP5.2 JP6.2 JP7.2 JP8.2 | 3.81,39.12 5.46,37.47 v5.46,35.56
D+  (via drill 0.38)
  Top 0.254: U3.43 24.79,14.2 v25.4,13.59 | JP12.D+ 13.97,9.8 v14.22,10.06
  Bottom 0.254: v25.4,13.59 24.51,12.7 23.11,12.7 22.1,11.68 20.19,11.68 18.57,10.06 v14.22,10.06
D-  (via drill 0.38)
  Top 0.254: U3.42 23.99,13.6 v24,13.59 | JP12.D- 13.17,9.89 v13.01,10.06
  Bottom 0.254: v24,13.59 23.24,13.59 21.84,12.19 19.94,12.19 18.26,10.52 15.04,10.52 14.61,10.95 13.39,10.95 13.03,10.59 13.03,10.08 v13.01,10.06
DIR_1  (via drill 0.38)
  Top 0.254: U3.5 28.79,20.79 28.79,20.74 v28.83,20.7 | U1.P$19 28.57,41.14 29.08,41.66 32.33,41.66 v32.99,42.32 32.99,43.18 32.99,43.41
  Top 0.406: D5.A 33.02,43.2 32.99,43.18
  Bottom 0.254: JP22.6 3.94,21.59 6.22,19.3 15.62,19.3 17.4,21.08 18.16,21.08 18.54,20.7 v28.83,20.7 28.96,20.7 29.59,20.07 30.73,20.07 33.97,23.3 33.97,26.29 35.18,27.5 35.18,38.35 32.99,40.54 v32.99,42.32
DIR_2  (via drill 0.38)
  Top 0.254: U3.3 25.29,19.19 v25.27,19.18 | 48.39,41.66 48.38,41.65 | 48.39,41.66 45.59,41.66 45.08,41.14 U2.P$19 | 48.39,41.66 v49.15,41.66 49.38,41.88 49.38,42.75 49.53,42.9 D6.A
  Bottom 0.254: v49.15,41.66 49.15,40.01 46.86,37.72 46.86,30.73 41.81,25.68 41.81,25.65 41.62,25.46 38.73,25.46 38.54,25.27 35.94,25.27 35.12,24.45 35.12,22.92 31.24,19.05 25.4,19.05 v25.27,19.18 22.61,19.18 22.1,19.68 18.54,19.68 17.14,18.29 4.57,18.29 JP22.5
ENABLE_1  (via drill 0.25, 0.38)
  Top 0.254: v11.43,23.62 11.43,26.92 11.94,27.43 15.05,27.43 15.24,27.62 15.24,28.57 15.88,29.21 21.97,29.21 v22.86,30.1 22.48,30.48 R5.2 | U1.P$2 19.95,41.64 v19.57,41.26 | U3.25 14.46,23.99 v14.35,23.88
  Bottom 0.254: JP22.7 10.92,24.13 v11.43,23.62 11.68,23.88 v14.35,23.88 | v22.86,30.1 22.23,30.1 20.19,32.13 20.19,33.78 19.56,34.42 18.36,34.42 17.68,35.1 17.68,39.47 17.65,39.5 17.65,40.51 18.4,41.26 v19.57,41.26
ENABLE_2  (via drill 0.38)
  Top 0.254: v17.78,20.19 17.78,17.65 18.39,17.04 U3.35 18.39,14.9 17.78,14.29 R6.2 | U2.P$2 35.8,41.64 v35.43,41.27
  Bottom 0.254: JP21.5 2.54,20.32 4.45,20.32 5.97,18.8 16.38,18.8 v17.78,20.19 28.19,20.19 28.83,19.56 30.99,19.56 34.54,23.11 34.54,26.1 35.75,27.3 35.75,40.96 v35.43,41.27 35.69,41.02
GND  (via drill 0.38)
  Top 0.254: JP22.12 3.94,36.83 | 24.38,41.14 v24.38,40.64 | 41.14,41.14 40.89,41.14 v40.89,40.64 | C16.1 C15.1 | 28.96,14.99 29.21,15.24 29.21,16.76 29.72,17.27
  Top 0.305: 20.58,41.14 U1.P$3 24.25,41.14 | 24.25,41.14 24.26,41.15 | v26.42,40.64 U1.P$18 31.5,40.64 | 41.15,41.15 41.14,41.14 U2.P$3 37.35,41.14 37.34,41.15 | U2.P$29 U2.P$18 47.75,40.64 | 24.25,41.14 24.38,41.14
  Top 0.813: 1.27,48.26 JP8.1 JP21.12 JP22.12 5.71,36.83 | 6.73,54.61 18.54,54.61
  Bottom 0.813: 1.27,49.53 JP8.1 JP21.12 JP22.12 | 6.35,54.61 19.05,54.61
  other vias: 20.19,45.85 21.59,43.18 28.07,43.18 30.1,43.18 30.48,48.77 20.19,47.24 21.72,45.85 26.42,41.66 24.38,41.66 24.38,39.62 26.42,39.62 27.94,33.34 30.48,33.34 32.77,33.34 23.24,33.02 40.89,41.66 42.93,41.66 42.93,39.62 40.89,39.62 37.34,45.72 38.1,43.18 45.72,43.18 46.99,49.02 46.99,47.62 36.7,48.39 36.7,49.66 39.24,33.27 44.01,30.54 49.53,33.34 42.23,30.54 21.59,33.02 46.35,46.23 41.91,41.66 42.93,40.64 41.91,39.62 41.91,40.64 25.4,40.64 25.4,41.66 25.4,39.62 49.53,47.75 50.8,41.4
  pour Top (isolate 0.305, rank 3): 0,55.88 0,0 55.88,0 55.88,55.88
  pour Bottom (isolate 0.305, rank 2): 0,27.94 0,55.88 55.88,55.88 55.88,29.21 52.07,29.21 52.07,27.94 50.8,26.67 33.46,26.67 33.46,28.38 33.08,28.38 33.02,30.99 6.73,30.99 6.73,27.94
M1_OUT1A
  Top 0.305: 25.9,49.4 U1.P$24
  Top 0.406: 25.9,49.4 25.9,50.03 JP19.2 26.67,52.45 JP13.2
M1_OUT1B
  Top 0.254: 30.73,42.16 30.71,42.14
  Top 0.305: 30.84,42.27 30.73,42.16 | 30.71,42.14 U1.P$21
  Top 0.406: 30.84,42.27 32,43.43 32,50.8 | 32,50.8 JP19.1 | 32,50.8 32,53.09 31.75,53.34 JP13.1
M1_OUT2A
  Top 0.305: 24.9,49.4 U1.P$26
  Top 0.406: 24.9,49.4 24.9,50.03 JP19.3 24.13,53.16 JP16.1
M1_OUT2B
  Top 0.305: U1.P$1 20.09,42.14 19.96,42.27
  Top 0.406: 19.96,42.27 19.05,43.18 19.05,48.26 JP19.4 21.59,52.96 21.08,53.47 20.58,53.47 JP16.2
M2_OUT1A
  Top 0.305: 42.41,49.27 U2.P$24
  Top 0.406: 42.41,50.8 42.41,49.27 | 42.41,50.8 JP20.2 | 42.41,50.8 42.41,53.22 42.29,53.34 JP17.2
M2_OUT1B
  Top 0.254: 47.24,42.16 47.22,42.14
  Top 0.305: 47.35,42.27 47.24,42.16 | 47.22,42.14 U2.P$21
  Top 0.406: 47.35,42.27 48.26,43.18 48.26,49.5 47.26,50.49 46.02,50.49 JP20.1 45.72,52.96 45.9,53.14 JP17.1
M2_OUT2A
  Top 0.305: 41.41,49.27 U2.P$26
  Top 0.406: 41.41,49.27 41.41,50.03 JP20.3 38.66,52.78 JP18.1
M2_OUT2B
  Top 0.305: U2.P$1 36.6,42.14 36.47,42.27
  Top 0.406: 36.47,42.27 35.56,43.18 35.56,50.8 | 35.56,50.8 JP20.4 | 35.56,50.8 35.56,52.83 35.05,53.34 JP18.2
MCLR  (via drill 0.38)
  Top 0.254: U1.P$12 25.9,33.14 25.91,33.13 25.92,33.13 27.3,31.75 28.57,31.75 30.61,29.72 v30.61,29.08 32.13,29.08 33.26,30.21 40.28,30.21 42.41,32.34 U2.P$12 | v18.67,17.91 19.81,19.05 19.81,23.24 v19.56,23.5 19.56,25.15 20.79,26.38 U3.18 | v36.51,23.81 35.43,22.73 S2.3 34.16,21.97 33.87,22.26 R22.1 | v51.1,27.81 53.47,27.81 JP23.1
  Bottom 0.254: v18.67,17.91 19.43,18.67 21.59,18.67 22.1,18.16 24.26,18.16 25.15,17.27 26.42,17.27 27.18,18.03 31.75,18.03 36.51,22.8 v36.51,23.81 36.96,24.26 39.05,24.26 39.24,24.45 42.1,24.45 43.56,25.91 50.29,25.91 51.05,26.67 51.05,27.76 v51.1,27.81 | v30.61,29.08 29.59,28.07 29.59,26.29 26.16,22.86 20.19,22.86 v19.56,23.5
MS1  (via drill 0.38)
  Top 0.254: U1.P$9 24.4,32.53 24.38,32.51 v24.38,31.62 | U2.P$9 40.91,33.54 39.43,32.07 v31.94,32.07 | U3.27 16.8,22.39 16.89,22.48 v17.27,22.48
  Bottom 0.254: v17.27,22.48 17.65,22.1 18.67,22.1 18.92,21.84 26.67,21.84 30.61,25.78 30.61,26.8 33.15,29.34 33.15,30.86 v31.94,32.07 24.83,32.07 v24.38,31.62
MS2  (via drill 0.38)
  Top 0.254: U1.P$10 24.9,32.52 24.89,32.51 26.16,31.24 v26.16,30.99 | U2.P$10 41.41,33.16 39.69,31.43 32.54,31.43 31.91,30.8 31.05,30.8 v30.99,30.86 | U3.26 16.71,23.19 16.89,23.37 18.03,23.37 v18.41,22.99
  Bottom 0.254: v18.41,22.99 18.54,22.99 19.18,22.35 26.42,22.35 30.1,26.04 30.1,27.05 32.64,29.59 32.64,30.32 32.1,30.86 v30.99,30.86 30.61,31.24 26.42,31.24 v26.16,30.99
MS3  (via drill 0.38)
  Top 0.254: U1.P$11 25.4,32.89 27.05,31.24 27.81,31.24 v29.08,29.97 | U2.P$11 41.91,32.77 41.85,32.77 39.95,30.87 32.65,30.87 v31.75,29.97 | U3.31 15.8,19.18 14.73,19.18 14.48,19.43 11.81,19.43 v10.54,20.7
  Bottom 0.254: v31.75,29.97 v29.08,29.97 29.08,26.54 25.91,23.37 20.95,23.37 19.94,24.38 19.18,24.38 18.67,23.88 18.03,23.88 17.53,23.37 16.89,23.37 16.38,22.86 16.38,21.59 15.11,20.32 10.92,20.32 v10.54,20.7
N$1
  Top 0.254: D6.C 50.92,45.33 R16.2
N$2  (via drill 0.51)
  Top 0.406: D10.C 43.94,13.86 F1.1 41.99,13.79 v41.91,13.72 | v35.56,13.59 33.78,13.59 33.27,13.08 33.27,11.61 D1.C
  Bottom 0.406: v41.91,13.72 35.69,13.72 v35.56,13.59
N$3
  Top 0.254: U1.P$4 21.72,40.64 19.3,38.23 C2.1
N$4
  Top 0.254: R13.2 R14.1 R18.1
N$5
  Top 0.254: U1.P$5 21.98,40.14 20.32,38.48 20.32,35.05 20.07,34.8 19.39,34.8 C2.2
N$6
  Top 0.813: D9.A 39.5,10.96 JP11.PWR
N$7
  Top 0.406: D5.C R15.2
N$8
  Top 0.406: R26.2 30.45,2.2 D8.C
N$9
  Top 0.254: 54.1,18.93 U4.1
  Top 0.406: R27.1 R23.1 53.09,22.52 53.09,21.46 54.1,20.45 54.1,18.93
N$10
  Top 0.406: D4.C 24.23,2.17 24.26,2.2 R25.2
N$11
  Top 0.254: D7.C R20.2
N$12
  Top 0.61: R19.1 16.3,44.7 | 16.3,44.7 16.3,44.41 16.89,43.81 U5.1 | R24.2 16.26,44.66 16.3,44.7
N$16
  Top 0.254: U2.P$4 38.1,40.64 35.56,38.1 C4.1
N$17
  Top 0.254: U2.P$5 38.49,40.14 36.58,38.23 36.58,35.05 36.23,34.71 C4.2
N$19
  Top 0.254: U1.P$13 26.4,37.35 27.3,36.45 27.9,36.45 R8.1
N$20
  Top 0.254: U1.P$8 23.9,37.49 23.75,37.34 23.5,37.34 23.37,37.21 C10.1
N$21
  Top 0.254: U1.P$6 22.24,39.64 21.34,38.73 C5.1
N$31
  Top 0.254: U1.P$27 24.4,48.12 24.26,48.26 R3.2
N$32
  Top 0.254: U1.P$23 26.4,48.12 26.54,48.26 R1.2
N$36
  Top 0.406: U4.3 49.12,17.97 46.2,17.97 46.14,18.03 | C15.2 46.14,18.03 | 46.14,18.03 46.14,16.09 46.74,15.49 46.74,13.85 F1.2
N$41
  Top 0.254: U2.P$6 38.75,39.64 37.85,38.73 C6.1
N$43
  Top 0.254: U2.P$23 42.91,48.12 43.05,48.26 R2.2
N$44
  Top 0.254: U2.P$27 40.91,48.12 40.77,48.26 R4.2
N$45
  Top 0.305: U2.P$8 40.41,37.55 40.01,37.15 40.01,36.54 C9.1
N$48
  Top 0.254: U2.P$13 42.91,37.1 43.56,36.45 44.41,36.45 R7.1
PRG_SW
  Top 0.254: U3.30 16.71,19.99 17.02,19.68 17.02,16.97 16.78,16.73 15.24,16.73 | S1.3 13.34,16.73 15.24,16.73 | 15.24,16.73 15.27,16.7 15.27,14.85 R21.1
RA1  (via drill 0.38)
  Top 0.254: 19.18,27.4 U3.20 19.19,26.56 18.54,25.91 v17.4,25.91
  Bottom 0.254: v17.4,25.91 16.64,25.15 5.46,25.15 3.94,26.67 JP22.8
RA2  (via drill 0.38)
  Top 0.254: U3.21 18.39,28.28 18.1,28.57 16.19,28.57 15.85,28.23 15.85,26.52 v15.84,26.5
  Bottom 0.254: JP21.8 2.54,27.94 4.45,27.94 6.73,25.65 14.99,25.65 v15.84,26.5
RA3  (via drill 0.38)
  Top 0.254: U3.22 16.81,27.39 v16.64,27.56
  Bottom 0.254: JP22.9 3.94,29.21 6.99,26.16 14.22,26.16 15.62,27.56 v16.64,27.56
RA5  (via drill 0.38)
  Top 0.254: U3.24 16.87,24.79 v17.27,24.38
  Bottom 0.254: v17.27,24.38 17.02,24.64 5.21,24.64 4.45,25.4 2.54,25.4 JP21.7
RB0  (via drill 0.38)
  Top 0.254: U3.8 23.47,23.19 v22.48,24.18
  Bottom 0.254: v22.48,24.18 22.78,23.88 25.02,23.88 25.78,24.64 25.78,26.47 24.43,27.81 22.23,27.81 17.78,32.26 14.86,32.26 11.05,36.07 11.05,49.02 JP2.3
RB1  (via drill 0.51)
  Top 0.254: U3.9 24.65,23.99 TP6.P$1
  Bottom 0.254: JP1.3 10.54,48.01 10.54,35.81 14.61,31.75 17.53,31.75 21.97,27.3 24.26,27.3 25.27,26.29 25.27,25.27 24.89,24.89 TP6.P$1
  other vias: 23.75,24.89
RB2  (via drill 0.38)
  Top 0.254: U3.10 26.26,24.79 26.04,25.02 26.04,26.04 26.67,26.67 v26.67,26.92
  Bottom 0.254: v26.67,26.92 26.04,26.92 24.64,28.32 22.48,28.32 18.03,32.77 15.11,32.77 11.56,36.32 11.56,46.99 JP3.3
RB3  (via drill 0.38)
  Top 0.254: U3.11 27.39,26.25 v28.07,26.92
  Bottom 0.254: v28.07,26.92 27.18,27.81 25.91,27.81 24.89,28.83 22.73,28.83 18.29,33.27 15.37,33.27 12.06,36.58 12.06,46.35 13.65,47.94 15.05,47.94 JP4.3
RB4  (via drill 0.38)
  Top 0.254: U3.14 23.99,26.45 v24.49,25.96
  Bottom 0.254: JP5.3 6.35,46.48 7.92,44.91 7.92,43.2 8.76,42.37 8.76,36.83 14.35,31.24 17.27,31.24 21.72,26.8 23.65,26.8 v24.49,25.96
RB5  (via drill 0.38)
  Top 0.254: U3.15 23.19,26.16 v22.99,25.96
  Bottom 0.254: JP6.3 6.35,43.94 8.26,42.04 8.26,36.58 14.1,30.73 17.02,30.73 21.46,26.29 22.66,26.29 v22.99,25.96
RB6  (via drill 0.38)
  Top 0.254: v23.88,17.27 20.95,20.19 20.95,23.88 21.84,24.77 v21.84,25.4 21.84,25.91 22.39,26.45 U3.16
  Bottom 0.254: v23.88,17.27 24.38,16.76 26.67,16.76 27.43,17.53 32,17.53 38.23,23.75 39.31,23.75 39.5,23.94 42.35,23.94 43.69,25.27 51.56,25.27 52.07,25.78 52.07,28.45 52.83,29.21 52.83,33.4 53.21,33.78 53.21,36.45 53.59,36.83 JP23.5 | v21.84,25.4 21.59,25.4 16.76,30.23 13.84,30.23 7.75,36.32 7.75,40.01 6.35,41.4 JP7.3
RB7  (via drill 0.38)
  Top 0.254: v22.61,17.27 20.45,19.43 20.45,24.77 v20.7,25.02 20.7,25.53 21.59,26.42 U3.17
  Bottom 0.254: v22.61,17.27 23.62,16.26 26.92,16.26 27.69,17.02 32.26,17.02 38.48,23.24 39.56,23.24 39.75,23.43 42.61,23.43 43.81,24.64 51.69,24.64 52.58,25.53 52.58,27.69 53.34,28.45 53.34,33.02 JP23.4 | v20.7,25.02 20.7,25.53 16.51,29.72 13.59,29.72 6.35,36.96 JP8.3
RC0  (via drill 0.38)
  Top 0.254: U3.32 14.63,18.39 14.1,18.92 12.57,18.92 9.65,16 v9.14,16
  Bottom 0.254: v9.14,16 8.26,16.89 4.19,16.89 JP22.4
RC2  (via drill 0.38)
  Top 0.254: U3.36 19.19,17.16 v19.81,17.78 | v30.1,16.13 R14.2
  Bottom 0.254: JP21.3 2.54,15.24 4.57,15.24 5.08,15.75 7.87,15.75 8.64,14.99 9.78,14.99 11.05,16.26 18.29,16.26 v19.81,17.78 20.19,18.16 21.21,18.16 21.72,17.65 21.72,16.51 22.48,15.75 27.18,15.75 27.69,16.26 29.97,16.26 v30.1,16.13
RC6  (via drill 0.38)
  Top 0.254: v26.42,14.22 26.16,14.22 25.59,14.8 U3.44
  Bottom 0.254: v26.42,14.22 26.16,14.48 23.11,14.48 22.1,13.46 21.08,13.46 20.32,14.22 14.35,14.22 11.94,11.81 10.54,11.81 8.89,10.16 2.54,10.16 JP21.1
RC7  (via drill 0.38)
  Top 0.254: 27.37,17.59 U3.1 27.33,17.53 28.45,17.53 28.7,17.27 28.7,16 v28.07,15.37 | 10.2,13.59 R12.2 R17.1 12.57,13.68 v12.57,14.86
  Bottom 0.254: v28.07,15.37 27.94,15.24 12.95,15.24 v12.57,14.86 11.94,14.86 9.78,12.7 2.54,12.7 JP21.2
RD0  (via drill 0.38)
  Top 0.254: U3.38 20.79,17.23 v20.83,17.27
  Bottom 0.254: v20.83,17.27 19.3,15.75 11.3,15.75 10.03,14.48 8.38,14.48 7.62,15.24 5.46,15.24 4.19,13.97 JP22.3
RD1  (via drill 0.38)
  Top 0.254: v21.59,14.35 U3.39
  Bottom 0.254: v21.59,14.35 21.21,14.73 14.1,14.73 11.68,12.32 10.29,12.32 9.4,11.43 JP22.2
REF_RA0  (via drill 0.38)
  Top 0.254: v18.29,25.02 18.54,25.02 19.99,26.47 U3.19 19.99,28.37 20.32,28.7 22.99,28.7 v24,29.72 | v27.3,30.35 28.57,29.08 29.34,29.08 30.23,28.19 30.99,28.19 31.37,28.57 32.51,28.57 33.6,29.67 34.29,29.67 | 34.29,29.67 v34.29,27.81 | TP3.1 10.73,30.48 11.11,30.1 11.11,29.27 R11.2 | v47.18,39.62 46.67,40.13 44.45,40.13 44.44,40.14 U2.P$17 | U1.P$17 29.07,40.14 29.53,39.69 31.3,39.69 v31.43,39.56 | 34.29,29.67 42.41,29.67 v42.74,29.34
  Bottom 0.254: v34.29,27.81 34.67,28.19 34.67,38.1 33.53,39.24 31.75,39.24 v31.43,39.56 | v42.74,29.34 44.7,29.34 46.35,30.99 46.35,38.8 v47.18,39.62 | v18.29,25.02 18.29,27.18 16.89,28.57 15.88,28.57 13.97,26.67 11.28,26.67 | 11.28,26.67 7.24,26.67 5.46,28.45 5.46,29.46 4.45,30.48 2.54,30.48 JP21.9 | v24,29.72 26.67,29.72 v27.3,30.35 | TP3.1 10.16,30.48 11.3,29.34 11.3,26.7 11.28,26.67
SLEEP_1
  Top 0.254: U1.P$14 26.9,37.62 27.05,37.47 28.57,37.47 29.59,36.45 30.48,36.45 R9.2
SLEEP_2
  Top 0.254: R10.2 46.99,36.45 46.1,36.45 45.09,37.47 43.5,37.47 43.41,37.55 U2.P$14
STEP_1  (via drill 0.25, 0.38)
  Top 0.254: U3.4 28.27,19.99 28.45,19.81 29.34,19.81 v30.35,20.83 | U1.P$16 28.81,39.64 29.59,38.86 v30.1,38.86
  Bottom 0.254: JP21.6 2.54,22.86 4.45,22.86 7.49,19.81 15.37,19.81 17.14,21.59 18.41,21.59 18.8,21.21 26.8,21.21 27.18,21.59 30.1,21.59 30.35,21.34 v30.35,20.83 30.48,20.95 30.86,20.95 33.4,23.5 33.4,28.07 34.16,28.83 34.16,37.85 33.4,38.61 30.35,38.61 v30.1,38.86
STEP_2  (via drill 0.38)
  Top 0.254: U3.2 26.14,18.39 v25.91,18.16 | U2.P$16 45.77,39.64 46.99,38.42 48.2,38.42 v48.51,38.1
  Bottom 0.254: v48.51,38.1 47.37,36.96 47.37,30.48 42.06,25.17 42.06,25.15 41.87,24.96 38.99,24.96 38.8,24.77 36.2,24.77 35.62,24.19 35.62,22.67 31.5,18.54 26.29,18.54 v25.91,18.16 25.02,18.16 24.51,18.67 22.35,18.67 21.84,19.18 18.8,19.18 17.4,17.78 2.54,17.78 JP21.4
USB_LED  (via drill 0.38)
  Top 0.254: U3.41 23.19,12.88 24.89,11.18 v25.4,11.18 | v31.88,3.43 31.3,4 30.57,4 30.49,3.92 D8.A
  Bottom 0.254: v25.4,11.18 30.35,11.18 31.75,9.78 31.75,3.43 v31.88,3.43
USR_LED  (via drill 0.38)
  Top 0.254: U3.40 22.39,11.65 v23.81,10.22 | v21.59,2.54 21.59,3.5 22,3.91 22.85,3.91 D4.A 22.86,3.81
  Bottom 0.254: v21.59,2.54 21.59,3.17 23.81,5.4 v23.81,10.22
V+  (via drill 0.38, 0.51)
  Top 0.254: v37.85,33.21 C6.2 | 23.9,44.45 C7.1 | 26.9,44.45 C8.1 | v19.3,33.4 20.7,33.4 21.34,34.04 C5.2
  Top 0.305: U1.P$28 23.9,44.45 23.9,45.19 v23.37,45.72 | U1.P$22 26.9,44.45 26.9,45.19 v27.43,45.72 | 40.41,44.45 40.41,45.19 v39.88,45.72 | 40.41,44.45 U2.P$28 | 40.41,44.45 C11.1 | 43.41,44.45 43.41,45.06 v44.07,45.72 | 43.41,44.45 U2.P$22 | 43.41,44.45 C12.1
  Top 0.406: v30.1,46.99 29.59,46.99 28.32,45.72 v27.43,45.72 | v39.88,45.72 38.99,45.72 37.72,46.99 v37.08,46.99 | C14.+ 37.5,27.94 | D10.A 42.49,20.38 41.78,21.08 39.69,21.08 D9.C 39.37,21.14 39.37,19.43 34.76,14.82 R13.1 | U5.3 12.32,45.64 C21.2
  Top 0.61: 14.31,46.1 v14.38,46.04 14.21,45.87 C21.2
  Top 0.813: 37.48,27.08 37.15,27.41 37.15,27.68 C14.+ | 37.5,27.94 38.1,27.94 38.73,27.3 | 38.73,27.3 38.42,26.99 38.42,25.46 39.62,24.26 39.62,21.4 D9.C | 38.73,27.3 40.48,27.3 v40.7,27.08
  Bottom 0.254: v19.3,33.4 18.92,33.4 18.54,33.78 17.73,33.78 16.92,34.59 16.92,46.01
  Bottom 0.406: v27.43,45.72 v23.37,45.72 | v39.88,45.72 v44.07,45.72 | 16.92,46.01 16.54,46.01 16.51,46.04
  Bottom 0.61: v37.08,46.99 34.04,46.99 v30.1,46.99 27.81,49.28 20.45,49.28 17.21,46.04 16.51,46.04 v14.38,46.04
  Bottom 0.813: 37.72,33.02 37.72,41.91 34.04,45.59 34.04,46.99 | 37.72,33.02 37.72,28.16 38.8,27.08 v40.7,27.08 | v37.85,33.21 37.85,33.15 37.72,33.02
VBUS  (via drill 0.38)
  Top 0.254: JP12.VBUS
  Top 0.406: v13.97,5.11 13.44,5.11 12.37,6.17 JP12.VBUS 12.37,9.47 11.71,10.13 10.74,10.13 10.16,10.72 R12.1 | D1.A 33.34,9.22 v33.39,9.27
  Bottom 0.254: 29.9,12.06 29.9,12.09
  Bottom 0.406: v13.97,5.11 16.48,7.62 19.05,7.62 23.5,12.06 29.9,12.06 32.38,12.06 33.27,11.18 33.27,9.38 v33.39,9.27
VCAP
  Top 0.254: U3.23 13.21,25.59 C22.A

### Text on the board
Top: schmalzhaus.com/EBB | EiBot | Board
Bottom: v2.4
tPlace: GND | GND | 5V | 5V | GND | B1 | B0 | B2 | B3 | B4 | MOTOR1 | MOTOR2 | DIR2 | B5 | DIR1 | 3.3V | B6 | B7 | GND | 3.3V | schmalzhaus.com/EBB | TP3 | 5V | CURRENT | A0 | A3 | ADJ | 3.3V | A2 | A1 | ICSP | MAX | A5 | E0 | D6 | D7 | C1 | D5 | D4 | C0 | RST | C2 | D0 | PRG | C7 | D1 | C6 | GND | EBB | J5 | J4 | EiBot | Board | v2.4 | PWR | IN | GND | USR | USB | 9-25VDC
bPlace: GND | 5V | GND | 5V | B1 | B0 | B2 | B3 | GND | B5 | B4 | Arm | Pen | MOTOR 1 | MOTOR 2 | 3.3V | B6 | Servos | B7 | GND | GND | PGC(RB6) | 3.3V | 3.3V | EiBotBoard | PGD(RB7) | 5V | 5V | ICSP | GND | A0 | A3 | Released under Creative | Commons V3.0 Attribution | 3.3V | A2 | A1 | Licence by SchmalzHaus | MCLR | A5 | E0 | D6 | D7 | C1 | D5 | D4 | C0 | C2 | D0 | C7 | D1 | C6 | GND | IO PINS | J5 | J4 | for more information see: | www.schmalzhaus.com/EBB
Measures: Dimensions in inches
tDocu: Licensed under Creative Commons v3.0 Attribution License | Design by: Brian Schmalz | Revision by Toni Klopfenstein